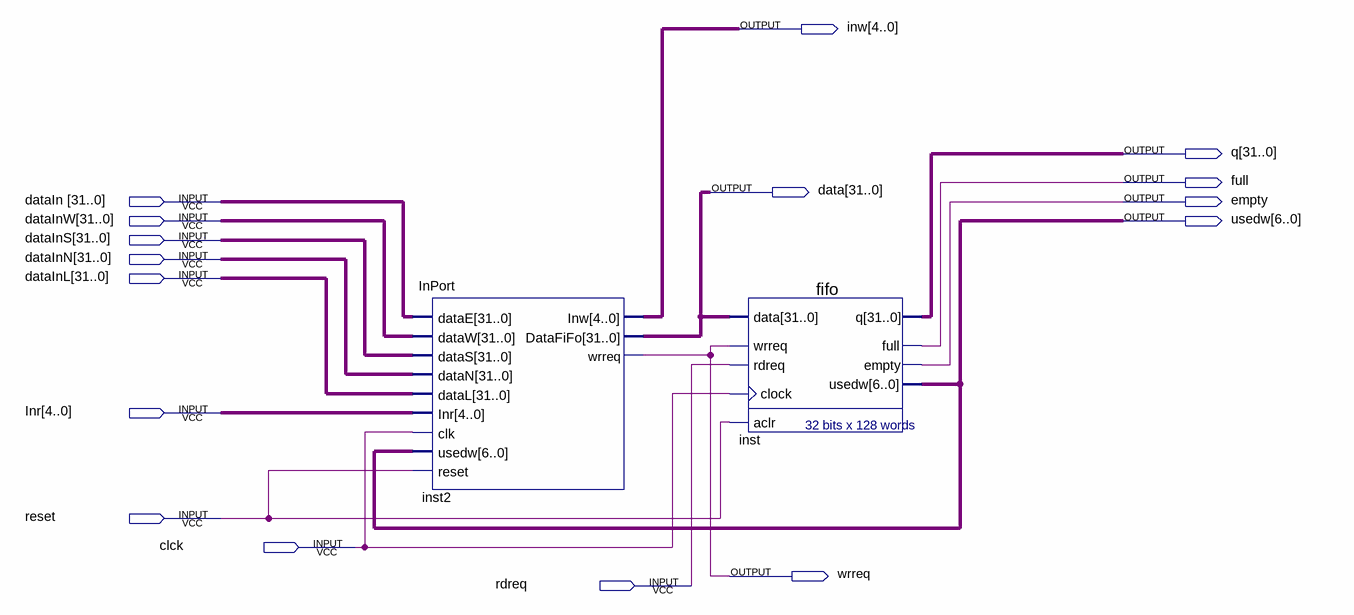
[diagram p0: schematic sheet]
// Quartus schematic NoCSimp2.bdf as structural Verilog: 2 symbols, 16 pins
module NoCSimp2 (
  input  [31:0] dataIn,
  input  [31:0] dataInW,
  input  [31:0] dataInS,
  input  [31:0] dataInN,
  input  [31:0] dataInL,
  input  [4:0] Inr,
  input  reset,
  input  clck,
  input  rdreq,
  output [4:0] inw,
  output [31:0] q,
  output full,
  output [31:0] data,
  output empty,
  output [6:0] usedw,
  output wrreq
);

  InPort inst2 (
    .dataE(dataIn), .dataW(dataInW), .dataS(dataInS), .dataN(dataInN), .dataL(dataInL), .Inr(Inr),
    .clk(clck), .usedw(usedw), .reset(reset), .Inw(inw), .DataFiFo(data), .wrreq(wrreq));
  fifo inst (
    .data(data), .wrreq(wrreq), .rdreq(rdreq), .clock(clck), .aclr(reset), .q(q), .full(full), .empty(empty),
    .usedw(usedw));
endmodule
